# EAGLE design 12VAC-DC-v6 (EAGLE 7.5.0)
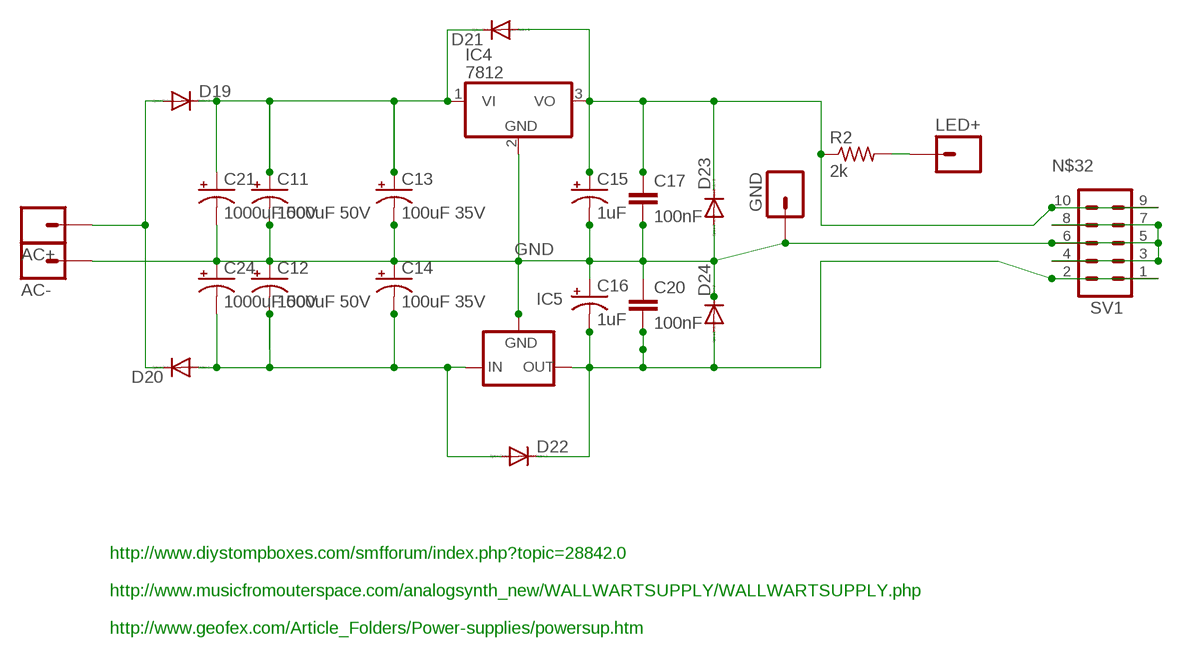
[diagram p0: schematic, sheet 1]

## Parts
C11  1000uF 50V  CPOL-USE5-13  [E5-13]
C12  1000uF 50V  CPOL-USE5-13  [E5-13]
C13  100uF 35V  CPOL-USE2.5-6  [E2,5-6]
C14  100uF 35V  CPOL-USE2.5-6  [E2,5-6]
C15  1uF  CPOL-USE2.5-5  [E2,5-5]
C16  1uF  CPOL-USE2.5-5  [E2,5-5]
C17  100nF  C-EU025-024X044  [C025-024X044]
C20  100nF  C-EU025-024X044  [C025-024X044]
C21  1000uF 50V  CPOL-USE5-13  [E5-13]
C24  1000uF 50V  CPOL-USE5-13  [E5-13]
D19  DIODE-D-7.5  [D-7.5]
D20  DIODE-D-7.5  [D-7.5]
D21  DIODE-D-5  [D-5]
D22  DIODE-D-5  [D-5]
D23  DIODE-D-2.5  [D-2.5]
D24  DIODE-D-5  [D-5]
IC4  7812  7812TV  [TO220V]
IC5  79XXS  [79XXS]
JP6  AC+  M01PTH_LONGPAD  [1X01_LONGPAD]
JP22  AC-  M01PTH_LONGPAD  [1X01_LONGPAD]
JP25  GND  M01PTH_LONGPAD  [1X01_LONGPAD]
JP26  LED+  M01PTH_LONGPAD  [1X01_LONGPAD]
R2  2k  R-US_0204/2V  [0204V]
SV1  M05X2SHD  [2X5-SHROUDED]

## Nets
GND: C11.- C12.+ C13.- C14.+ C15.- C16.+ C17.2 C20.1 C21.- C24.+ D23.A D24.C IC4.2(GND) IC5.GND JP22.1 JP25.1 SV1.3 SV1.4 SV1.5 SV1.6 SV1.7 SV1.8
N$27: C11.+ C13.+ C21.+ D19.C D21.C IC4.1(VI)
N$32: C15.+ C17.1 D21.A D23.C IC4.3(VO) R2.1 SV1.9 SV1.10
N$34: C16.- C20.2 D22.C D24.A IC5.OUT SV1.1 SV1.2
N$35: C12.- C14.- C24.- D20.A D22.A IC5.IN
N$36: D19.A D20.C JP6.1
N$37: JP26.1 R2.2

## Notes on the sheet
- http://www.diystompboxes.com/smfforum/index.php?topic=28842.0
  
  http://www.musicfromouterspace.com/analogsynth_new/WALLWARTSUPPLY/WALLWARTSUPPLY.php
  
  http://www.geofex.com/Article_Folders/Power-supplies/powersup.htm

## Library data of the parts
C11-C16 C21 C24 = rcl:CPOL-US: POLARIZED CAPACITOR, American symbol
C17 C20 = rcl:C-EU: CAPACITOR, European symbol
D19-D24 = diode:DIODE-: DIODE
IC4 = linear:78*: Positive VOLTAGE REGULATOR Source: http://cache.national.com/ds/LM/LM78L05.pdf http://www.fairchildsemi.com/ds/LM/LM7805.pdf
IC5 = v-reg:79XXS: VOLTAGE REGULATOR
JP6 JP22 JP25 JP26 = !syinsi:M01: Header 1 Standard 1-pin 0.1" header. Use with straight break away headers (SKU : PRT-00116), right angle break away headers (PRT-00553), swiss pins (PRT-00743), machine pins (PRT-00117), and female headers (PRT-00115).
R2 = !syinsi:R-US_: RESISTOR, American symbol
SV1 = !syinsi:M05X2: Header 5x2 Standard 10-pin dual row 0.1" header. Commonly used with AVR-ISP. Use with Spark Fun Electronics SKU: PRT-00778

## Board
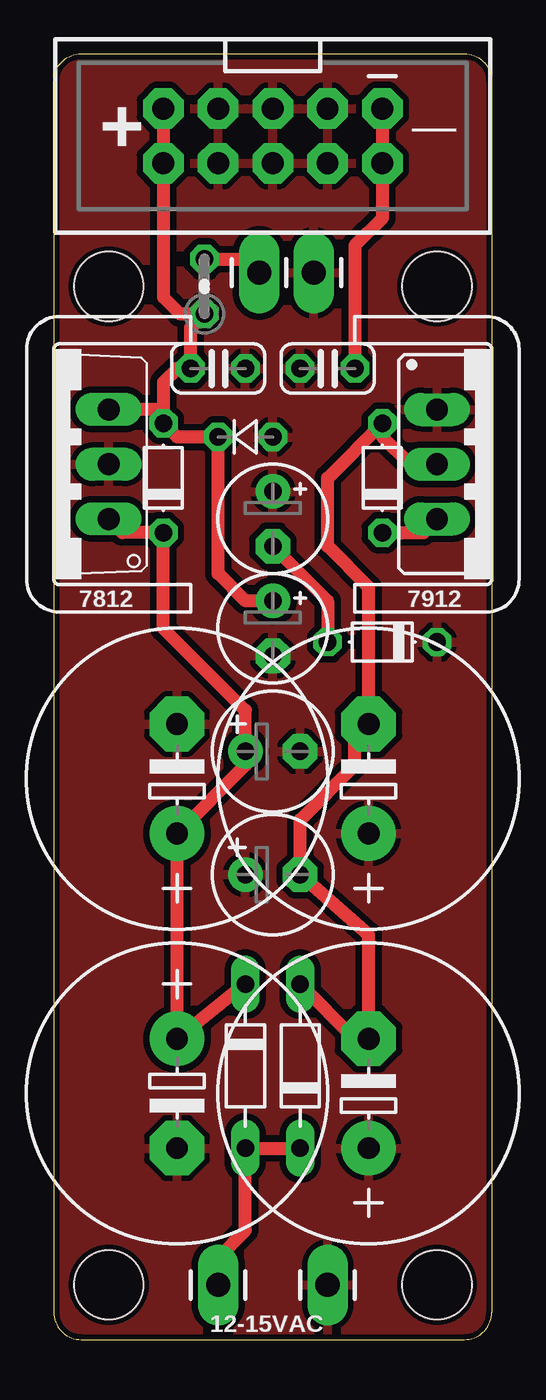
[diagram p1: board, top side]
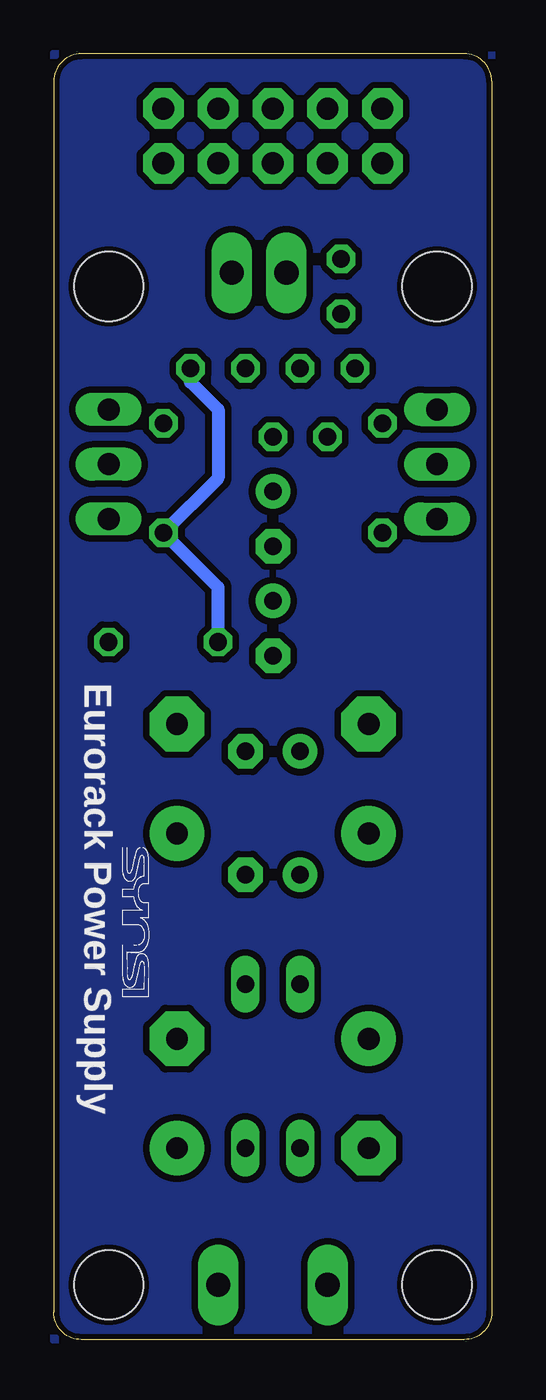
[diagram p2: board, bottom side, seen from below]

Size 20.32 x 59.69 mm. Coordinates in mm from the lower left corner, seen from the top.
Outline: 0,1.27 arc90 1.27,0 19.05,0 arc90 20.32,1.27 20.32,58.42 arc90 19.05,59.69 1.27,59.69 arc90 0,58.42 0,1.27
Copper layers (1*16): Top 0.035mm / dielectric 1.5mm / Bottom 0.035mm
Design rules "dirt_cheap_dirty_boards.v1 *": minimum track width 16mil, minimum drill 12mil, track to track 12mil, track to pad 12mil, pad to pad 12mil, via to via 12mil, smd to smd 0mil, copper to edge 10mil, drill to drill 10mil, minimum pad ring 10mil, minimum via ring 6mil, stop-mask expansion 2mil, vias tented up to drill 25mil, thermal gap 10mil
Holes 3.2 mm at 2.54,2.54 17.78,2.54 17.78,48.9 2.54,48.9

### Footprints (pad centres in the part's own frame; a part is rotated, then mirrored left to right if it is on the bottom)
E5-13 = drill 1.016 pad 2.54: + -2.54,0 | drill 1.016 pad 2.54 octagon: - 2.54,0
E2,5-6 = drill 0.813 pad 1.6: + -1.27,0 | drill 0.813 pad 1.6 octagon: - 1.27,0
E2,5-5 = drill 0.813 pad 1.6: + -1.27,0 | drill 0.813 pad 1.6 octagon: - 1.27,0
C025-024X044 = drill 0.813 octagon: 1 -1.27,0; 2 1.27,0
D-7.5 = drill 0.813 long: A 3.81,0; C -3.81,0
D-5 = drill 0.813 octagon: A 2.54,0; C -2.54,0
D-2.5 = drill 0.813 octagon: A 1.27,0; C -1.27,0
TO220V = drill 1.016 long: 1 -2.54,-2.54; 2 0,-2.54; 3 2.54,-2.54
79XXS = drill 1.016 long: GND -2.54,-2.54; IN 0,-2.54; OUT 2.54,-2.54
1X01_LONGPAD = drill 1.118 pad 1.88 long: 1 0,0
0204V = drill 0.813 octagon: 1 -1.27,0; 2 1.27,0
2X5-SHROUDED = drill 1.016 pad 1.88 octagon: 1 -1.27,5.08; 2 1.27,5.08; 3 -1.27,2.54; 4 1.27,2.54; 5 -1.27,0; 6 1.27,0; 7 -1.27,-2.54; 8 1.27,-2.54; 9 -1.27,-5.08; 10 1.27,-5.08

### Placement (x,y rotation side)
C11  5.71,26.04 90 top
C12  14.61,26.04 90 top
C13  10.16,27.3 0 top
C14  10.16,21.59 0 top
C15  10.16,33.02 270 top
C16  10.16,38.1 270 top
C17  7.62,45.09 0 top
C20  12.7,45.09 0 top
C21  5.71,11.43 270 top
C24  14.61,11.43 90 top
D19  8.89,12.7 270 top
D20  11.43,12.7 90 top
D21  5.08,40.01 90 top
D22  15.24,40.01 90 top
D23  8.89,41.91 0 top
D24  15.24,32.38 180 top
IC4  0,40.64 90 top
IC5  20.32,40.64 270 top
JP6  7.62,2.54 180 top
JP22  12.7,2.54 180 top
JP25  12.06,49.53 0 top
JP26  9.53,49.53 0 top
R2  6.99,48.9 90 top
SV1  10.16,55.88 270 top
U$13  [SYINSI-LOGO-2-MED-SILK-REV]  17.14,22.86 90 top
U$14  [D03S]  20.32,40.64 90 top
U$15  [D03S]  0,40.64 270 top

### Tracks (layer width: path | path; a pad name or v marks a point on that pad's centre or on a via)
GND
  Top 0.406: 10.16,57 SV1.5 | 7.67,54.86 SV1.8
  Bottom 0.406: 10.16,54.86 SV1.6 | 7.49,56.63 7.26,56.63 SV1.7 7.76,57.13 7.75,57.02 | 7.67,54.86 SV1.8
  pour Top: 0,0 20.32,0 20.32,59.69 0,59.69
N$1
  pour Bottom: 0,0 20.32,0 20.32,59.69 0,59.69
N$27
  Top 0.61: D19.C C21.+ C11.+ 8.89,26.67 C13.+ 8.89,29.21 5.08,33.02 D21.C 3.17,37.47 IC4.1
N$32
  Top 0.61: C15.+ 8.89,34.29 7.62,35.56 D23.C 5.71,41.91 D21.A 5.08,43.18 | 5.08,43.18 IC4.3 | 5.08,43.18 5.08,44.45 5.71,45.09 C17.1 6.35,46.99 R2.1 5.84,47.62 5.08,48.39 SV1.10 SV1.9
N$34
  Top 0.61: SV1.1 SV1.2 15.24,52.07 13.97,50.8 C20.2 | D22.C 17.14,37.47 IC5.OUT | C16.- 12.7,34.29 D24.A
  Bottom 0.61: C20.2 13.97,44.45 12.7,43.18 12.7,40.01 D22.C 12.7,34.92 D24.A
N$35
  Top 0.61: 15.24,13.97 C24.- | D20.A 13.97,13.97 C24.- | C24.- 14.61,18.8 C14.- 11.43,24.13 13.97,26.67 13.97,27.94 C12.- 14.61,34.92 12.7,36.83 12.7,40.01 D22.A 15.24,41.91 16.51,40.64 IC5.IN
N$36
  Top 0.61: JP6.1 7.62,3.81 8.89,5.08 D19.A D20.C
N$37
  Top 0.61: R2.2 8.89,50.16 JP26.1

### Text on the board
bPlace: Eurorack Power Supply
tNames: 12-15VAC
_tsilk: + | _ | 7812 | 7912